# Altium schematic sheet ConnectorOut.SchDoc
size A4
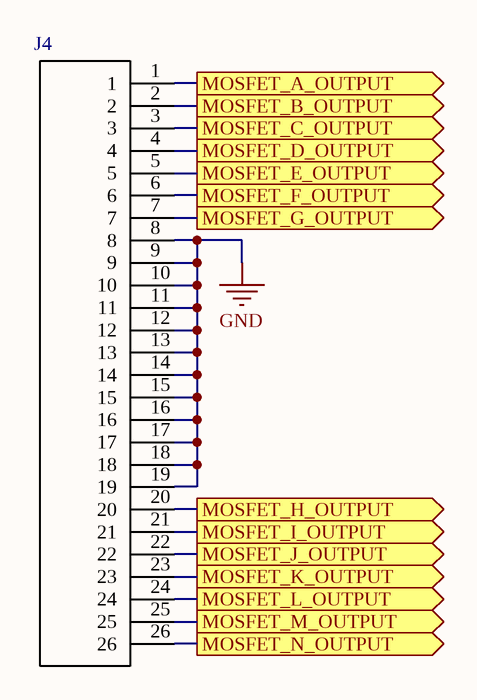
[diagram p0: ConnectorOut.SchDoc]

## Parts
J4  6473418-1  [TE_6473418-1]  (value not drawn)

## Ports
MOSFET_A_OUTPUT (out), MOSFET_B_OUTPUT (out), MOSFET_C_OUTPUT (out), MOSFET_D_OUTPUT (out), MOSFET_E_OUTPUT (out), MOSFET_F_OUTPUT (out), MOSFET_G_OUTPUT (out), MOSFET_H_OUTPUT (out), MOSFET_I_OUTPUT (out), MOSFET_J_OUTPUT (out), MOSFET_K_OUTPUT (out), MOSFET_L_OUTPUT (out), MOSFET_M_OUTPUT (out), MOSFET_N_OUTPUT (out)

## Nets
GND: J4.8 J4.9 J4.10 J4.11 J4.12 J4.13 J4.14 J4.15 J4.16 J4.17 J4.18 J4.19
MOSFET_A_OUTPUT: J4.1 ; port MOSFET_A_OUTPUT
MOSFET_B_OUTPUT: J4.2 ; port MOSFET_B_OUTPUT
MOSFET_C_OUTPUT: J4.3 ; port MOSFET_C_OUTPUT
MOSFET_D_OUTPUT: J4.4 ; port MOSFET_D_OUTPUT
MOSFET_E_OUTPUT: J4.5 ; port MOSFET_E_OUTPUT
MOSFET_F_OUTPUT: J4.6 ; port MOSFET_F_OUTPUT
MOSFET_G_OUTPUT: J4.7 ; port MOSFET_G_OUTPUT
MOSFET_H_OUTPUT: J4.20 ; port MOSFET_H_OUTPUT
MOSFET_I_OUTPUT: J4.21 ; port MOSFET_I_OUTPUT
MOSFET_J_OUTPUT: J4.22 ; port MOSFET_J_OUTPUT
MOSFET_K_OUTPUT: J4.23 ; port MOSFET_K_OUTPUT
MOSFET_L_OUTPUT: J4.24 ; port MOSFET_L_OUTPUT
MOSFET_M_OUTPUT: J4.25 ; port MOSFET_M_OUTPUT
MOSFET_N_OUTPUT: J4.26 ; port MOSFET_N_OUTPUT

## Notes on the sheet
- Title
- Size:
- Date:
- A4
- Number:
- Time:
- Revision:
- Sheet
- of
- File:

## Library data of the parts
J4 = 6473418-1: Conn Shrouded Header PIN 26 POS 3mm Solder ST Thru-Hole Automotive Tube; MF: TE Connectivity; Package: None; Digi-Key_Purchase_URL: https://www.digikey.com/product-detail/en/te-connectivity-amp-connectors/6473418-1/A121634-ND/2329277?utm_source=snapeda&utm_medium=aggregator&utm_campaign=symbol; MP: 6473418-1; TE_purchase_URL: https://www.te.com/usa-en/product-6473418-1.html?te_bu=Cor&te_type=disp&te_campaign=seda_glo_cor-seda-global-disp-prtnr-fy19-seda-model-bom-cta_sma-317_1&elqCampaignId=32493; EU_RoHS_Compliance: Compliant; Digi-Key_Part_Number: A121634-ND; SnapEDA_Link: https://www.snapeda.com/parts/6473418-1/TE%20Connectivity%20AMP%20Connectors/view-part/?ref=snap; Value: *